# EAGLE board PCB-Neopixel Developer (EAGLE 9.5.2)
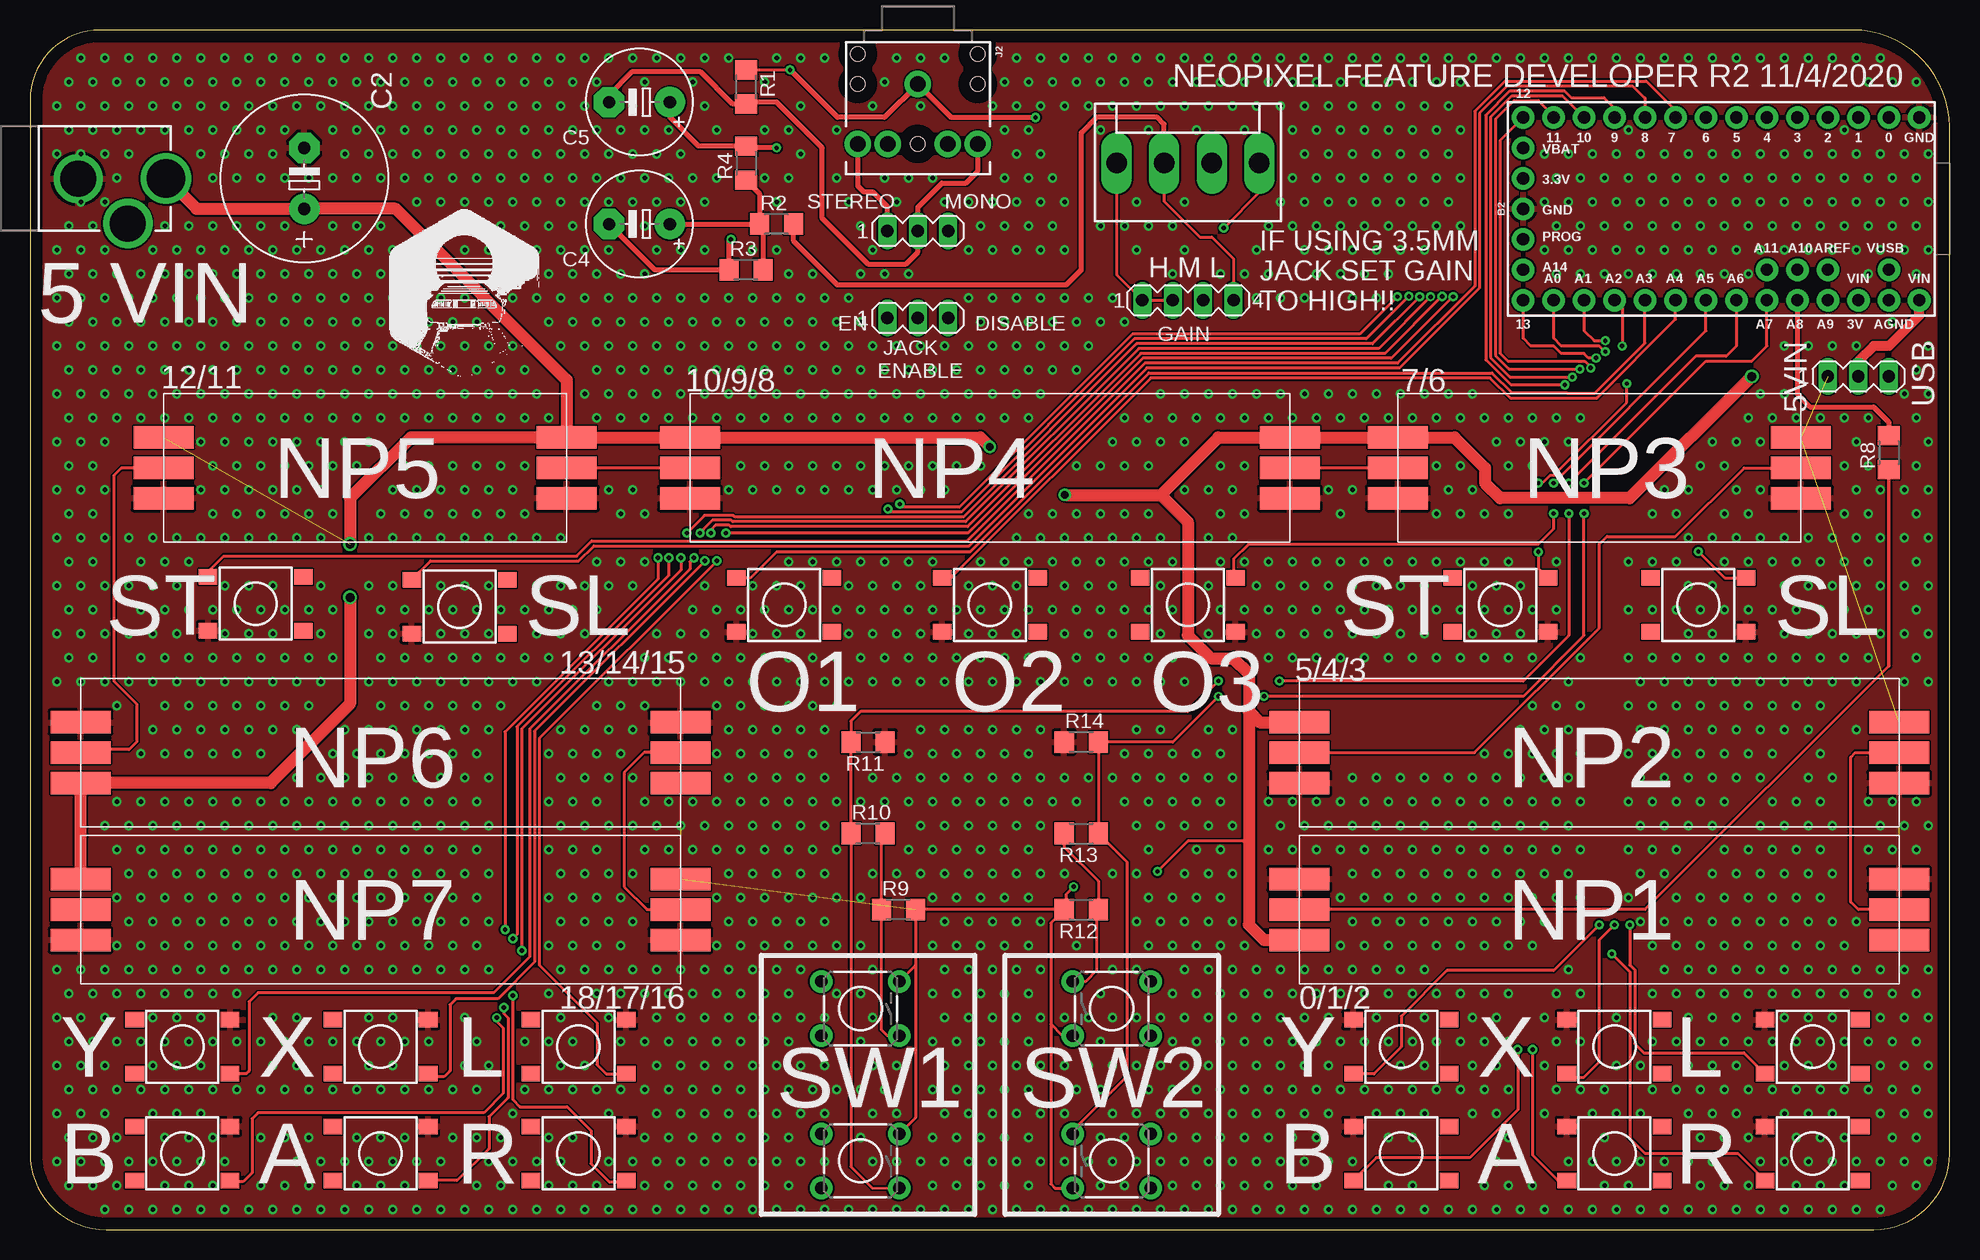
[diagram p1: board, top side]
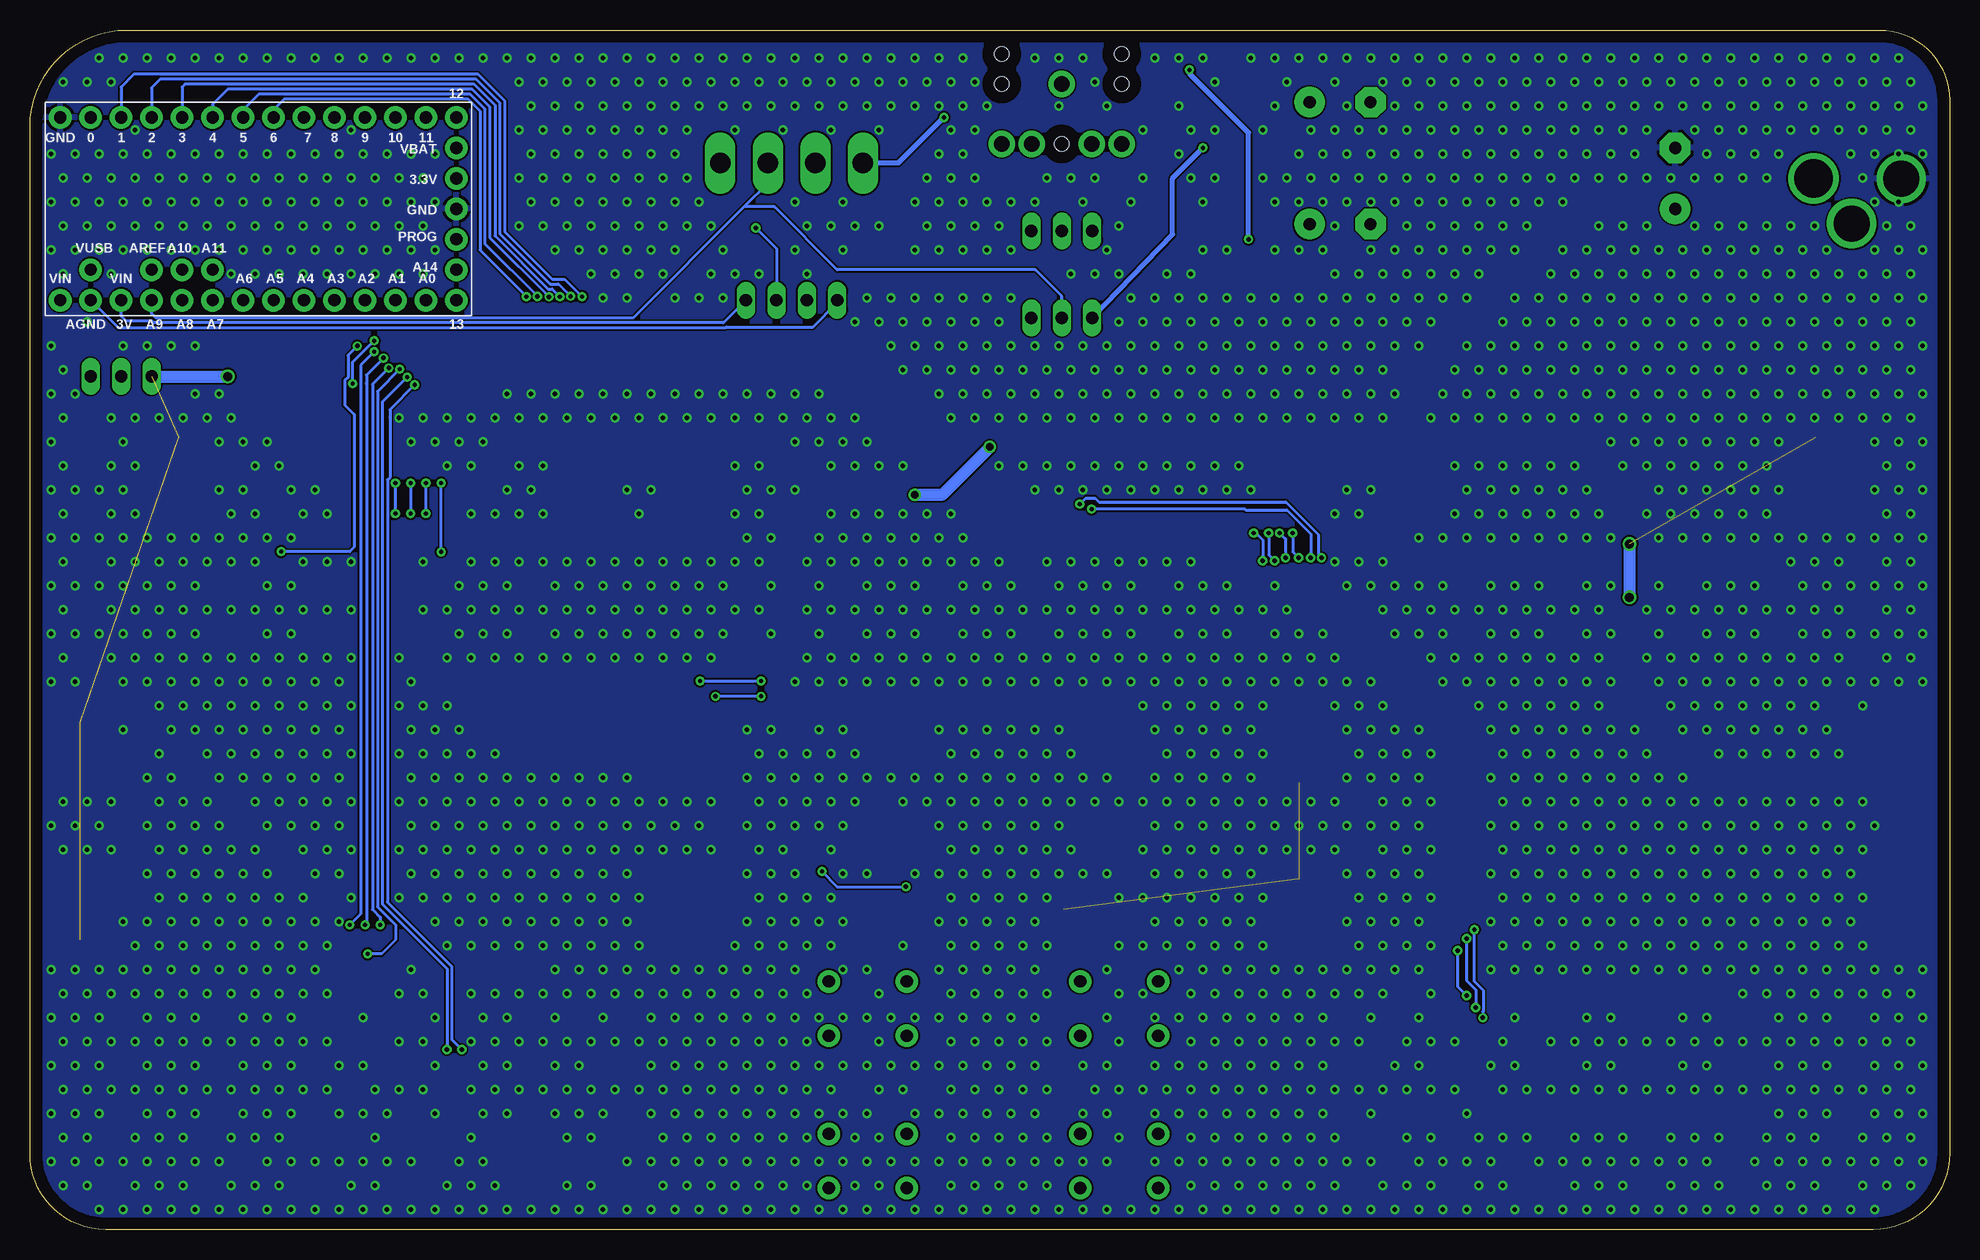
[diagram p2: board, bottom side, seen from below]

Size 160 x 100 mm. Coordinates in mm from the lower left corner, seen from the top.
Outline: 151.93,100 5.85,100 arc90 0,94.15 0,6.35 arc90 6.35,0 153.69,0 arc90 160,6.31 160,91.93 arc90 151.93,100
Copper layers (1*16): Top 0.035mm / dielectric 1.5mm / Bottom 0.035mm
Design rules "default": minimum track width 6mil, minimum drill 0.35mm, track to track 6mil, track to pad 6mil, pad to pad 6mil, via to via 6mil, smd to smd 6mil, copper to edge 40mil, drill to drill 6mil, minimum pad ring 10mil, minimum via ring 8mil, stop-mask expansion 4mil, vias tented up to drill 0.5mm, thermal gap 10mil

## Footprints (pad centres in the part's own frame; a part is rotated, then mirrored left to right if it is on the bottom)
TEENSY-3.1 = drill 1.016 pad 1.88: 0 7.62,-13.97; 1 7.62,-11.43; 2 7.62,-8.89; 3 7.62,-6.35; 3.3V 2.54,16.51; 3V -7.62,-11.43; 4 7.62,-3.81; 5 7.62,-1.27; 6 7.62,1.27; 7 7.62,3.81; 8 7.62,6.35; 9 7.62,8.89; 10 7.62,11.43; 11 7.62,13.97; 12 7.62,16.51; 13 -7.62,16.51; 14 -7.62,13.97; 15 -7.62,11.43; 16 -7.62,8.89; 17 -7.62,6.35; 18 -7.62,3.81; 19 -7.62,1.27; 20 -7.62,-1.27; 21 -7.62,-3.81; 22 -7.62,-6.35; 23 -7.62,-8.89; A10 -5.08,-6.35; A11 -5.08,-3.81; A14/DAC -5.08,16.51; AGND -7.62,-13.97; AREF -5.08,-8.89; GND 0,16.51; GND1 7.62,-16.51; PROG -2.54,16.51; VBAT 5.08,16.51; VIN -7.62,-16.51; VUSB -5.08,-13.97
E5-13 = drill 1.016 pad 2.54: + -2.54,0 | drill 1.016 pad 2.54 octagon: - 2.54,0
E5-8,5 = drill 1.016 pad 2.54: + -2.54,0 | drill 1.016 pad 2.54 octagon: - 2.54,0
MA04-1 = drill 1.016 long: 1 -3.81,0; 2 -1.27,0; 3 1.27,0; 4 3.81,0
POWER_JACK_PTH_LOCK = drill 2.997 pad 4.115: GND 0.025,6.557; GNDBREAK 3.762,10.7 | drill 3.2 pad 4.115: PWR 0,13.878
AUDIO-JACK = drill 1.3 pad 2.184: RING 5,5; RSH 5,2.5; SLEEVE 0,0; TIP 5,-5; TSH 5,-2.5 | hole 1.2: 0,5; -2.5,5; -2.5,-5; 0,-5; 5,0
KK-156-4 = drill 1.7 pad 2.184 long: 1 -5.94,0; 2 -1.98,0; 3 1.98,0; 4 5.94,0
R1206 = smd 1.6 x 1.803: 1 -1.422,0; 2 1.422,0
TACTILE_SWITCH_SMD_6.2MM_TALL = smd 1.55 x 1.3: A1 -3.975,-2.25; A2 3.975,-2.25; B1 -3.975,2.25; B2 3.975,2.25
TACTILE_SWITCH_PTH_6.0MM = drill 1.016 pad 1.88: 1 -3.251,2.261; 2 3.251,2.261; 3 -3.251,-2.261; 4 3.251,-2.261
MA03-1 = drill 1.016 long: 1 -2.54,0; 2 0,0; 3 2.54,0
NP-2 = smd 5 x 1.85: DIN 16.8,0; DOUT -16.8,0; GND -16.8,-2.54; GND1 16.8,-2.54; VIN -16.8,2.54; VOUT 16.8,2.54
NP-3 = smd 5 x 1.85: DIN 25,0; DOUT -25,0; GND -25,-2.54; GND1 25,-2.54; VIN -25,2.54; VOUT 25,2.54

## Placement (x,y rotation side)
B2  TEENSY-3.2  [TEENSY-3.1]  140.97,85.09 90 top
C2  4700uf  [E5-13]  22.86,87.63 90 top
C4  10UF  [E5-8,5]  50.8,83.82 180 top
C5  10UF  [E5-8,5]  50.8,93.98 180 top
GAIN  [MA04-1]  96.52,77.47 0 top
J1  POWER_JACKPTH_LOCK  [POWER_JACK_PTH_LOCK]  -2.54,87.63 270 top
J2  AUDIO_JACK_3.5MM_PTH  [AUDIO-JACK]  74,95.5 270 top
MICROPHONE  [KK-156-4]  96.52,88.9 0 top
R1  47K  [R1206]  59.69,95.25 270 top
R2  10K  [R1206]  62.23,83.82 0 top
R3  2.2K  [R1206]  59.69,80.01 0 top
R4  47K  [R1206]  59.69,88.9 90 top
R8  470 Ohm  [R1206]  154.94,64.77 90 top
R9  1K  [R1206]  72.39,26.67 0 top
R10  1K  [R1206]  69.85,33.02 0 top
R11  10K  [R1206]  69.85,40.64 180 top
R12  1K  [R1206]  87.63,26.67 180 top
R13  1K  [R1206]  87.63,33.02 180 top
R14  10K  [R1206]  87.63,40.64 0 top
S1  MOMENTARY-SWITCH-SPST-SMD-6.2MM-TALL  [TACTILE_SWITCH_SMD_6.2MM_TALL]  12.7,6.35 0 top
S2  MOMENTARY-SWITCH-SPST-SMD-6.2MM-TALL  [TACTILE_SWITCH_SMD_6.2MM_TALL]  29.21,6.35 0 top
S3  MOMENTARY-SWITCH-SPST-SMD-6.2MM-TALL  [TACTILE_SWITCH_SMD_6.2MM_TALL]  45.72,6.35 0 top
S4  MOMENTARY-SWITCH-SPST-SMD-6.2MM-TALL  [TACTILE_SWITCH_SMD_6.2MM_TALL]  12.7,15.24 0 top
S5  MOMENTARY-SWITCH-SPST-SMD-6.2MM-TALL  [TACTILE_SWITCH_SMD_6.2MM_TALL]  29.21,15.24 0 top
S6  MOMENTARY-SWITCH-SPST-SMD-6.2MM-TALL  [TACTILE_SWITCH_SMD_6.2MM_TALL]  45.72,15.24 0 top
S7  MOMENTARY-SWITCH-SPST-SMD-6.2MM-TALL  [TACTILE_SWITCH_SMD_6.2MM_TALL]  18.82,52.18 180 top
S8  MOMENTARY-SWITCH-SPST-SMD-6.2MM-TALL  [TACTILE_SWITCH_SMD_6.2MM_TALL]  35.8,51.93 180 top
S9  MOMENTARY-SWITCH-SPST-SMD-6.2MM-TALL  [TACTILE_SWITCH_SMD_6.2MM_TALL]  62.87,52.07 180 top
S10  MOMENTARY-SWITCH-SPST-SMD-6.2MM-TALL  [TACTILE_SWITCH_SMD_6.2MM_TALL]  80.01,52.07 180 top
S11  MOMENTARY-SWITCH-SPST-SMD-6.2MM-TALL  [TACTILE_SWITCH_SMD_6.2MM_TALL]  114.3,6.35 180 top
S12  MOMENTARY-SWITCH-SPST-SMD-6.2MM-TALL  [TACTILE_SWITCH_SMD_6.2MM_TALL]  132.08,6.35 180 top
S13  MOMENTARY-SWITCH-SPST-SMD-6.2MM-TALL  [TACTILE_SWITCH_SMD_6.2MM_TALL]  148.59,6.35 180 top
S14  MOMENTARY-SWITCH-SPST-SMD-6.2MM-TALL  [TACTILE_SWITCH_SMD_6.2MM_TALL]  114.3,15.24 180 top
S15  MOMENTARY-SWITCH-SPST-SMD-6.2MM-TALL  [TACTILE_SWITCH_SMD_6.2MM_TALL]  132.08,15.24 180 top
S16  MOMENTARY-SWITCH-SPST-SMD-6.2MM-TALL  [TACTILE_SWITCH_SMD_6.2MM_TALL]  148.59,15.24 180 top
S17  MOMENTARY-SWITCH-SPST-SMD-6.2MM-TALL  [TACTILE_SWITCH_SMD_6.2MM_TALL]  122.56,52.07 0 top
S18  MOMENTARY-SWITCH-SPST-SMD-6.2MM-TALL  [TACTILE_SWITCH_SMD_6.2MM_TALL]  139.06,52.07 0 top
S19  MOMENTARY-SWITCH-SPST-SMD-6.2MM-TALL  [TACTILE_SWITCH_SMD_6.2MM_TALL]  96.52,52.07 0 top
S20  MOMENTARY-SWITCH-SPST-PTH-6.0MM  [TACTILE_SWITCH_PTH_6.0MM]  69.22,18.41 180 top
S21  MOMENTARY-SWITCH-SPST-PTH-6.0MM  [TACTILE_SWITCH_PTH_6.0MM]  69.22,5.71 180 top
S22  MOMENTARY-SWITCH-SPST-PTH-6.0MM  [TACTILE_SWITCH_PTH_6.0MM]  90.17,18.41 0 top
S23  MOMENTARY-SWITCH-SPST-PTH-6.0MM  [TACTILE_SWITCH_PTH_6.0MM]  90.17,5.71 0 top
ST/MN  [MA03-1]  74,83.25 0 top
SV2  [MA03-1]  74,76 0 top
SV3  [MA03-1]  152.4,71.12 0 top
U$2  NP-2  [NP-2]  130.81,63.5 0 top
U$7  NP-2  [NP-2]  27.94,63.5 0 top
U$8  NP-3  [NP-3]  29.21,39.75 180 top
U$10  NP-3  [NP-3]  29.21,26.67 0 top
U$11  NP-3  [NP-3]  80.01,63.5 0 top
U$12  NP-3  [NP-3]  130.81,26.67 180 top
U$13  NP-3  [NP-3]  130.81,39.75 0 top

## Tracks (layer width: path | path; a pad name or v marks a point on that pad's centre or on a via)
3VIN
  Top 0.254: MICROPHONE.2 94.54,85.71 97.5,82.75 98.5,82.75 100.33,80.92 GAIN.4
  Top 0.406: MICROPHONE.2 94.54,92.15 93.98,92.71 88.9,92.71 87.63,91.44 87.63,80.01 86.36,78.74 67.31,78.74 63.65,82.4 R2.2
  Bottom 0.254: GAIN.4 102.21,75.59 149.67,75.59 149.82,75.75 152,75.75 152.4,76.15 B2.3V
5VIN  (via drill 0.35, 0.6, 0.75)  (6 unrouted)
  Top 0.254: 101.6,32.38 96.52,32.38 v93.98,29.84 | v87,28.57 86.36,27.94 86.36,26.82 R12.2 | R12.2 R9.2 73.81,22.02 | 73.81,22.02 S20.3 | 73.81,22.02 73.81,9.32 S21.3 | R12.2 85.09,25.55 85.09,17.14 | 85.09,17.14 85.09,3.81 85.45,3.45 S23.3 | S22.3 86.08,16.15 85.09,17.14
  Top 1.016: J1.PWR 13.88,85.09 C2.+ 30.48,85.09 44.74,70.83 U$7.VOUT | U$7.VOUT U$11.VIN 79.21,66.04 v80,65.25 | v86.25,61.25 94.27,61.25 | 94.27,61.25 99.06,66.04 U$11.VOUT U$2.VIN 118.75,66.04 121.28,63.5 121.28,62.23 122.56,60.96 133.35,60.96 v143.51,71.12 | 94.27,61.25 96.52,59 96.52,49.53 98.42,47.62 100.33,47.62 101.6,46.35 101.6,43.18 | U$13.VIN 102.49,42.29 101.6,43.18 | 101.6,43.18 101.6,32.38 101.6,25.4 102.87,24.13 U$12.VOUT | U$7.VOUT 31.75,66.04 26.67,60.96 v26.67,57.15 | v26.67,52.7 26.67,43.81 20.07,37.21 U$8.VOUT U$10.VIN
  Bottom 0.254: v93.98,29.84 92.71,28.57 v87,28.57
  Bottom 1.016: v80,65.25 84,61.25 v86.25,61.25 | SV3.1 v143.51,71.12 | v26.67,57.15 v26.67,52.7
AGND  (via drill 0.35)
  Top 0.254: MICROPHONE.1 90.58,79.6 GAIN.1 GAIN.2 | R1.1 v63.35,96.67
  Top 0.406: C4.- 52.07,80.01 R3.1 58.27,82.4 v58.42,82.55 | v63.35,96.67 67.31,92.71 71.21,92.71 J2.SLEEVE 76.79,92.71 v83.82,92.71
  Bottom 0.254: B2.AGND 152.66,75.19 102.04,75.19 101.97,75.25 94.75,75.25 92.71,77.29 GAIN.1
  Bottom 0.406: v83.82,92.71 87.63,88.9 MICROPHONE.1 | v58.42,82.55 58.42,91.44 63.35,96.37 v63.35,96.67
D1
  Top 0.254: U$12.DIN 134.62,26.67 154.94,46.99
  Top 0.305: R8.1 154.94,46.99
D2
  Top 0.254: U$12.DOUT 152.4,26.67 151.76,27.3 151.76,39.37 152.15,39.75 U$13.DIN
D3
  Top 0.254: U$13.DOUT 120.4,39.75 130.81,50.16 130.81,57.15 131.44,57.78 137.16,57.78 142.88,63.5 U$2.DIN
D4
  Top 0.254: U$2.DOUT U$11.DIN
D5
  Top 0.254: U$11.DOUT U$7.DIN
D6
  Top 0.254: U$8.DIN 4.46,40.01 8.26,40.01 8.89,40.64 8.89,43.81 6.99,45.72 6.99,62.87 7.62,63.5 U$7.DOUT
D7
  Top 0.254: U$8.DOUT 51.18,39.75 49.53,38.1 49.53,28.57 51.44,26.67 U$10.DIN
GAIN  (via drill 0.35)
  Top 0.254: MICROPHONE.4 102.46,86.46 v99.5,83.5
  Bottom 0.254: GAIN.3 97.75,77.51 97.75,81.75 v99.5,83.5
GND  (via drill 0.35)
  other vias: 2.25,5.67 2.25,9.67 2.25,13.67 2.25,17.67 2.25,21.67 2.25,45.67 2.25,49.67 2.25,53.67 2.25,57.67 2.25,61.67 2.25,65.67 2.25,69.67 2.25,73.67 2.25,77.67 2.25,81.67 2.25,89.67 2.25,93.67 3.25,3.67 4.25,5.67 3.25,7.67 4.25,9.67 3.25,11.67 4.25,13.67 3.25,15.67 4.25,17.67 3.25,19.67 4.25,21.67 4.25,45.67 3.25,47.67 4.25,49.67 3.25,51.67 4.25,53.67 3.25,55.67 4.25,57.67 3.25,59.67 4.25,61.67 3.25,63.67 4.25,65.67 3.25,67.67 4.25,69.67 3.25,71.67 4.25,73.67 3.25,75.67 4.25,77.67 3.25,79.67 4.25,81.67 3.25,83.67 4.25,85.67 4.25,89.67 3.25,91.67 4.25,93.67 3.25,95.67 4.25,97.67 6.25,1.67 5.25,3.67 6.25,5.67 5.25,7.67 6.25,9.67 5.25,11.67 6.25,13.67 5.25,15.67 6.25,17.67 5.25,19.67 6.25,21.67 6.25,33.67 6.25,45.67 5.25,47.67 6.25,49.67 5.25,51.67 6.25,53.67 5.25,55.67 6.25,57.67 5.25,59.67 6.25,61.67 5.25,63.67 6.25,65.67 5.25,67.67 6.25,69.67 5.25,71.67 6.25,73.67 5.25,75.67 6.25,77.67 5.25,79.67 6.25,81.67 5.25,83.67 6.25,85.67 6.25,89.67 5.25,91.67 6.25,93.67 5.25,95.67 6.25,97.67 8.25,1.67 7.25,3.67 8.25,5.67 7.25,7.67 7.25,11.67 7.25,15.67 7.25,19.67 8.25,21.67 7.25,23.67 8.25,25.67 7.25,27.67 8.25,29.67 7.25,31.67 8.25,33.67 7.25,35.67 7.25,43.67 8.25,45.67 8.25,49.67 8.25,53.67 8.25,57.67 7.25,67.67 8.25,69.67 7.25,71.67 8.25,73.67 7.25,75.67 8.25,77.67 7.25,79.67 7.25,87.67 8.25,89.67 7.25,91.67 8.25,93.67 7.25,95.67 8.25,97.67 10.25,1.67 10.25,5.67 10.25,9.67 9.25,11.67 10.25,13.67 9.25,15.67 10.25,17.67 9.25,19.67 10.25,21.67 9.25,23.67 10.25,25.67 9.25,27.67 10.25,29.67 9.25,31.67 10.25,33.67 9.25,35.67 9.25,39.67 10.25,41.67 10.25,45.67 9.25,47.67 10.25,49.67 9.25,51.67 10.25,53.67 9.25,55.67 10.25,57.67 9.25,67.67 10.25,69.67 9.25,71.67 10.25,73.67 9.25,75.67 10.25,77.67 9.25,79.67 10.25,81.67 9.25,91.67 10.25,93.67 9.25,95.67 10.25,97.67 12.25,1.67 11.25,3.67 12.25,5.67 11.25,7.67 12.25,9.67 11.25,11.67 12.25,13.67 11.25,15.67 12.25,17.67 11.25,19.67 12.25,21.67 11.25,23.67 12.25,25.67 11.25,27.67 12.25,29.67 11.25,31.67 12.25,33.67 11.25,35.67 11.25,39.67 12.25,41.67 11.25,43.67 12.25,45.67 11.25,47.67 12.25,49.67 11.25,51.67 12.25,53.67 11.25,55.67 12.25,57.67 11.25,67.67 12.25,69.67 11.25,71.67 12.25,73.67 11.25,75.67 12.25,77.67 11.25,79.67 12.25,81.67 11.25,83.67 11.25,91.67 12.25,93.67 11.25,95.67 12.25,97.67 14.25,1.67 13.25,3.67 14.25,5.67 13.25,7.67 14.25,9.67 13.25,11.67 14.25,13.67 13.25,15.67 14.25,17.67 13.25,19.67 14.25,21.67 13.25,23.67 14.25,25.67 13.25,27.67 14.25,29.67 13.25,31.67 14.25,33.67 13.25,35.67 13.25,39.67 14.25,41.67 13.25,43.67 14.25,45.67 13.25,47.67 13.25,51.67 13.25,55.67 14.25,57.67 14.25,61.67 14.25,65.67 13.25,67.67 14.25,69.67 13.25,71.67 14.25,73.67 13.25,75.67 14.25,77.67 13.25,79.67 14.25,81.67 13.25,83.67 14.25,89.67 13.25,91.67 14.25,93.67 13.25,95.67 14.25,97.67 16.25,1.67 15.25,3.67 16.25,5.67 15.25,7.67 15.25,11.67 15.25,15.67 15.25,19.67 16.25,21.67 15.25,23.67 16.25,25.67 15.25,27.67 16.25,29.67 15.25,31.67 16.25,33.67 15.25,35.67 15.25,39.67 16.25,41.67 15.25,43.67 16.25,45.67 15.25,47.67 16.25,49.67 15.25,51.67 16.25,53.67 16.25,57.67 15.25,59.67 16.25,61.67 15.25,63.67 16.25,65.67 15.25,67.67 16.25,69.67 15.25,71.67 16.25,73.67 15.25,75.67 16.25,77.67 15.25,79.67 16.25,81.67 15.25,83.67 15.25,87.67 16.25,89.67 15.25,91.67 16.25,93.67 15.25,95.67 16.25,97.67 18.25,1.67 17.25,11.67 17.25,15.67 17.25,19.67 18.25,21.67 17.25,23.67 18.25,25.67 17.25,27.67 18.25,29.67 17.25,31.67 18.25,33.67 17.25,35.67 17.25,39.67 18.25,41.67 17.25,43.67 18.25,45.67 17.25,47.67 18.25,49.67 17.25,51.67 18.25,53.67 18.25,57.67 17.25,59.67 18.25,61.67 17.25,63.67 18.25,65.67 17.25,67.67 18.25,69.67 17.25,71.67 18.25,73.67 17.25,75.67 18.25,77.67 17.25,79.67 18.25,81.67 17.25,83.67 17.25,87.67 18.25,89.67 17.25,91.67 18.25,93.67 17.25,95.67 18.25,97.67 20.25,1.67 19.25,3.67 20.25,5.67 19.25,7.67 19.25,11.67 20.25,13.67 19.25,15.67 20.25,17.67 20.25,21.67 19.25,23.67 20.25,25.67 19.25,27.67 20.25,29.67 19.25,31.67 20.25,33.67 19.25,35.67 19.25,39.67 20.25,41.67 19.25,43.67 20.25,45.67 19.25,47.67 20.25,49.67 19.25,51.67 20.25,53.67 20.25,57.67 19.25,59.67 20.25,61.67 19.25,63.67 20.25,65.67 19.25,67.67 20.25,69.67 19.25,71.67 20.25,73.67 19.25,75.67 20.25,77.67 19.25,79.67 20.25,81.67 19.25,83.67 19.25,87.67 20.25,89.67 19.25,91.67 20.25,93.67 19.25,95.67 20.25,97.67 22.25,1.67 21.25,3.67 22.25,5.67 21.25,7.67 21.25,11.67 22.25,13.67 21.25,15.67 22.25,17.67 22.25,21.67 21.25,23.67 22.25,25.67 21.25,27.67 22.25,29.67 21.25,31.67 22.25,33.67 21.25,35.67 22.25,37.67 22.25,41.67 21.25,43.67 22.25,45.67 21.25,47.67 21.25,51.67 22.25,57.67 21.25,59.67 22.25,61.67 21.25,63.67 22.25,65.67 21.25,67.67 22.25,69.67 21.25,71.67 22.25,73.67 21.25,75.67 22.25,77.67 21.25,79.67 22.25,81.67 21.25,83.67 21.25,87.67 21.25,91.67 22.25,93.67 21.25,95.67 22.25,97.67 24.25,1.67 23.25,3.67 24.25,5.67 23.25,7.67 23.25,11.67 23.25,15.67 24.25,21.67 23.25,23.67 24.25,25.67 23.25,27.67 24.25,29.67 23.25,31.67 24.25,33.67 23.25,35.67 24.25,37.67 23.25,43.67 24.25,45.67 23.25,47.67 24.25,49.67 23.25,51.67 24.25,53.67 24.25,57.67 23.25,59.67 24.25,61.67 23.25,63.67 24.25,65.67 23.25,67.67 24.25,69.67 23.25,71.67 24.25,73.67 23.25,75.67 24.25,77.67 23.25,79.67 24.25,81.67 23.25,87.67 24.25,93.67 23.25,95.67 24.25,97.67 26.25,1.67 26.25,5.67 25.25,11.67 25.25,15.67 26.25,21.67 25.25,23.67 26.25,25.67 25.25,27.67 26.25,29.67 25.25,31.67 26.25,33.67 25.25,35.67 26.25,37.67 25.25,39.67 26.25,41.67 25.25,47.67 25.25,51.67 25.25,59.67 25.25,63.67 26.25,65.67 25.25,67.67 26.25,69.67 25.25,71.67 26.25,73.67 25.25,75.67 26.25,77.67 25.25,79.67 26.25,81.67 25.25,83.67 25.25,87.67 26.25,89.67 25.25,91.67 26.25,93.67 25.25,95.67 26.25,97.67 28.25,1.67 27.25,3.67 28.25,5.67 27.25,7.67 27.25,11.67 28.25,13.67 27.25,15.67 28.25,17.67 28.25,21.67 27.25,23.67 28.25,25.67 27.25,27.67 28.25,29.67 27.25,31.67 28.25,33.67 27.25,35.67 28.25,37.67 27.25,39.67 28.25,41.67 28.25,45.67 28.25,49.67 28.25,53.67 28.25,57.67 27.25,63.67 28.25,65.67 27.25,67.67 28.25,69.67 27.25,71.67 28.25,73.67 27.25,75.67 28.25,77.67 27.25,79.67 28.25,81.67 27.25,83.67 27.25,87.67 28.25,89.67 27.25,91.67 28.25,93.67 27.25,95.67 28.25,97.67 30.25,1.67 29.25,3.67 30.25,5.67 29.25,7.67 29.25,11.67 30.25,13.67 29.25,15.67 30.25,17.67 30.25,21.67 29.25,23.67 30.25,25.67 29.25,27.67 30.25,29.67 29.25,31.67 30.25,33.67 29.25,35.67 30.25,37.67 29.25,39.67 30.25,41.67 29.25,43.67 30.25,45.67 29.25,47.67 30.25,49.67 29.25,51.67 30.25,53.67 30.25,57.67 29.25,59.67 30.25,61.67 29.25,67.67 30.25,69.67 29.25,71.67 30.25,73.67 29.25,75.67 30.25,77.67 29.25,79.67 30.25,81.67 29.25,83.67 29.25,87.67 30.25,89.67 29.25,91.67 30.25,93.67 29.25,95.67 30.25,97.67 32.25,1.67 31.25,3.67 32.25,5.67 31.25,7.67 31.25,11.67 31.25,15.67 32.25,21.67 31.25,23.67 32.25,25.67 31.25,27.67 32.25,29.67 31.25,31.67 32.25,33.67 31.25,35.67 32.25,37.67 31.25,39.67 32.25,41.67 31.25,43.67 32.25,45.67 31.25,47.67 31.25,51.67 32.25,57.67 31.25,59.67 32.25,61.67 31.25,63.67 31.25,67.67 32.25,69.67 31.25,71.67 32.25,73.67 31.25,75.67 32.25,77.67 31.25,79.67 32.25,81.67 32.25,85.67 31.25,87.67 32.25,89.67 31.25,91.67 32.25,93.67 31.25,95.67 32.25,97.67 34.25,1.67 34.25,5.67 33.25,11.67 33.25,15.67 34.25,21.67 33.25,23.67 34.25,25.67 33.25,27.67 34.25,29.67 33.25,31.67 34.25,33.67 33.25,35.67 34.25,37.67 33.25,39.67 34.25,41.67 33.25,43.67 34.25,45.67 33.25,47.67 34.25,49.67 33.25,51.67 34.25,53.67 34.25,57.67 33.25,59.67 34.25,61.67 33.25,63.67 33.25,67.67 34.25,69.67 33.25,71.67 34.25,73.67 33.25,75.67 34.25,77.67 33.25,79.67 34.25,85.67 33.25,87.67 34.25,89.67 33.25,91.67 34.25,93.67 33.25,95.67 34.25,97.67 36.25,1.67 35.25,7.67 35.25,11.67 36.25,13.67 36.25,17.67 36.25,21.67 35.25,23.67 36.25,25.67 35.25,27.67 36.25,29.67 35.25,31.67 36.25,33.67 35.25,35.67 36.25,37.67 35.25,39.67 36.25,41.67 35.25,43.67 36.25,45.67 35.25,47.67 36.25,49.67 35.25,51.67 36.25,53.67 36.25,57.67 35.25,59.67 36.25,61.67 35.25,63.67 35.25,67.67 36.25,69.67 35.25,71.67 36.25,73.67 35.25,75.67 36.25,77.67 36.25,81.67 35.25,83.67 36.25,85.67 35.25,87.67 36.25,89.67 35.25,91.67 36.25,93.67 35.25,95.67 36.25,97.67 38.25,1.67 37.25,3.67 38.25,5.67 37.25,7.67 37.25,11.67 38.25,13.67 37.25,15.67 38.25,21.67 37.25,23.67 38.25,25.67 37.25,27.67 38.25,29.67 37.25,31.67 38.25,33.67 37.25,35.67 38.25,37.67 37.25,39.67 38.25,41.67 37.25,43.67 38.25,45.67 37.25,47.67 38.25,49.67 37.25,51.67 38.25,53.67 38.25,57.67 37.25,59.67 38.25,61.67 37.25,63.67 37.25,67.67 38.25,69.67 37.25,71.67 38.25,73.67 37.25,75.67 38.25,81.67 37.25,83.67 38.25,85.67 37.25,87.67 38.25,89.67 37.25,91.67 38.25,93.67 37.25,95.67 38.25,97.67 40.25,1.67 39.25,3.67 40.25,5.67 39.25,7.67 40.25,9.67 39.25,43.67 40.25,45.67 39.25,47.67 39.25,51.67 40.25,57.67 39.25,59.67 40.25,61.67 39.25,63.67 39.25,67.67 40.25,69.67 39.25,71.67 40.25,73.67 40.25,77.67 39.25,79.67 40.25,81.67 39.25,83.67 40.25,85.67 39.25,87.67 40.25,89.67 39.25,91.67 40.25,93.67 39.25,95.67 40.25,97.67 42.25,1.67 42.25,5.67 41.25,11.67 41.25,15.67 42.25,45.67 41.25,47.67 42.25,49.67 41.25,51.67 42.25,53.67 42.25,57.67 41.25,59.67 41.25,63.67 41.25,67.67 42.25,69.67 41.25,71.67 42.25,77.67 41.25,79.67 42.25,81.67 41.25,83.67 42.25,85.67 41.25,87.67 42.25,89.67 41.25,91.67 42.25,93.67 41.25,95.67 42.25,97.67 44.25,1.67 43.25,3.67 44.25,5.67 43.25,7.67 43.25,11.67 44.25,13.67 43.25,15.67 44.25,17.67 43.25,19.67 44.25,21.67 43.25,23.67 44.25,25.67 43.25,27.67 44.25,29.67 43.25,31.67 44.25,33.67 43.25,35.67 44.25,37.67 43.25,39.67 44.25,41.67 43.25,47.67 44.25,49.67 43.25,51.67 44.25,53.67 44.25,57.67 43.25,67.67 44.25,73.67 43.25,75.67 44.25,77.67 43.25,79.67 44.25,81.67 43.25,83.67 44.25,85.67 43.25,87.67 44.25,89.67 43.25,91.67 44.25,93.67 43.25,95.67 44.25,97.67 46.25,1.67 45.25,3.67 45.25,7.67 45.25,11.67 46.25,13.67 45.25,15.67 46.25,21.67 45.25,23.67 46.25,25.67 45.25,27.67 46.25,29.67 45.25,31.67 46.25,33.67 45.25,35.67 46.25,37.67 45.25,39.67 46.25,41.67 46.25,49.67 45.25,51.67 46.25,53.67 46.25,69.67 46.25,73.67 45.25,75.67 46.25,77.67 45.25,79.67 46.25,81.67 45.25,83.67 46.25,85.67 45.25,87.67 46.25,89.67 45.25,91.67 46.25,93.67 45.25,95.67 46.25,97.67 48.25,1.67 47.25,3.67 48.25,5.67 48.25,9.67 47.25,11.67 48.25,17.67 47.25,19.67 48.25,21.67 47.25,23.67 48.25,25.67 47.25,27.67 48.25,29.67 47.25,31.67 48.25,33.67 47.25,35.67 48.25,37.67 47.25,39.67 48.25,41.67 47.25,43.67 48.25,45.67 47.25,51.67 48.25,53.67 47.25,55.67 48.25,61.67 47.25,67.67 48.25,69.67 47.25,71.67 48.25,73.67 47.25,75.67 48.25,77.67 47.25,79.67 48.25,81.67 48.25,85.67 47.25,87.67 48.25,89.67 47.25,91.67 47.25,95.67 48.25,97.67 50.25,1.67 50.25,5.67 49.25,11.67 49.25,15.67 49.25,19.67 50.25,21.67 49.25,23.67 50.25,25.67 49.25,27.67 50.25,29.67 50.25,33.67 50.25,37.67 49.25,39.67 50.25,41.67 49.25,43.67 50.25,45.67 50.25,53.67 49.25,55.67 49.25,59.67 50.25,61.67 49.25,67.67 50.25,69.67 49.25,71.67 50.25,73.67 49.25,75.67 50.25,77.67 49.25,79.67 50.25,85.67 49.25,87.67 50.25,89.67 49.25,91.67 50.25,93.67 50.25,97.67 52.25,1.67 51.25,3.67 52.25,5.67 51.25,7.67 52.25,9.67 51.25,11.67 52.25,13.67 51.25,15.67 52.25,17.67 51.25,19.67 52.25,21.67 51.25,31.67 52.25,33.67 51.25,35.67 51.25,43.67 52.25,45.67 51.25,47.67 52.25,49.67 51.25,55.67 51.25,59.67 51.25,67.67 52.25,69.67 51.25,71.67 52.25,73.67 51.25,75.67 52.25,77.67 51.25,79.67 52.25,81.67 51.25,83.67 52.25,85.67 51.25,87.67 52.25,89.67 51.25,91.67 51.25,95.67 52.25,97.67 54.25,1.67 53.25,3.67 54.25,5.67 53.25,7.67 54.25,9.67 53.25,11.67 54.25,13.67 53.25,15.67 54.25,17.67 53.25,19.67 54.25,21.67 53.25,31.67 54.25,33.67 53.25,35.67 54.25,45.67 53.25,47.67 54.25,49.67 53.25,67.67 54.25,69.67 53.25,71.67 54.25,73.67 53.25,75.67 54.25,77.67 54.25,81.67 54.25,85.67 53.25,87.67 54.25,89.67 53.25,91.67 54.25,97.67 56.25,1.67 55.25,3.67 56.25,5.67 55.25,7.67 56.25,9.67 55.25,11.67 56.25,13.67 55.25,15.67 56.25,17.67 55.25,19.67 56.25,21.67 55.25,31.67 56.25,33.67 55.25,35.67 56.25,45.67 55.25,47.67 56.25,49.67 55.25,51.67 56.25,53.67 55.25,67.67 56.25,69.67 55.25,71.67 56.25,73.67 55.25,75.67 56.25,77.67 56.25,81.67 56.25,85.67 55.25,87.67 56.25,93.67 55.25,95.67 56.25,97.67 58.25,1.67 57.25,3.67 58.25,5.67 57.25,7.67 58.25,9.67 57.25,11.67 58.25,13.67 57.25,15.67 58.25,17.67 57.25,19.67 58.25,21.67 57.25,23.67 58.25,25.67 57.25,27.67 58.25,29.67 57.25,31.67 58.25,33.67 57.25,35.67 58.25,37.67 57.25,39.67 58.25,41.67 57.25,43.67 58.25,45.67 57.25,47.67 57.25,51.67 58.25,61.67 57.25,67.67 58.25,69.67 57.25,71.67 58.25,73.67 57.25,75.67 58.25,77.67 57.25,87.67 57.25,91.67 58.25,97.67 60.25,1.67 59.25,3.67 60.25,5.67 59.25,7.67 60.25,9.67 59.25,11.67 60.25,13.67 59.25,15.67 60.25,17.67 59.25,19.67 60.25,21.67 59.25,23.67 60.25,25.67 59.25,27.67 60.25,29.67 59.25,31.67 60.25,33.67 59.25,35.67 60.25,37.67 59.25,39.67 60.25,41.67 59.25,43.67 60.25,45.67 59.25,47.67 60.25,49.67 59.25,51.67 60.25,53.67 60.25,61.67 59.25,63.67 59.25,67.67 60.25,69.67 59.25,71.67 60.25,73.67 59.25,75.67 60.25,77.67 60.25,81.67 62.25,1.67 61.25,3.67 62.25,5.67 61.25,7.67 62.25,9.67 61.25,11.67 62.25,13.67 61.25,15.67 62.25,17.67 61.25,19.67 62.25,21.67 61.25,23.67 62.25,25.67 61.25,27.67 62.25,29.67 61.25,31.67 62.25,33.67 61.25,35.67 62.25,37.67 61.25,39.67 62.25,41.67 61.25,43.67 62.25,45.67 61.25,47.67 62.25,49.67 61.25,51.67 62.25,53.67 62.25,61.67 61.25,63.67 61.25,67.67 62.25,69.67 61.25,71.67 62.25,73.67 61.25,75.67 62.25,77.67 62.25,81.67 62.25,85.67 61.25,87.67 61.25,91.67 61.25,95.67 62.25,97.67 64.25,1.67 63.25,3.67 64.25,5.67 63.25,7.67 64.25,9.67 63.25,11.67 64.25,13.67 63.25,15.67 64.25,17.67 63.25,19.67 64.25,21.67 63.25,23.67 64.25,25.67 63.25,27.67 64.25,29.67 63.25,31.67 64.25,33.67 63.25,35.67 64.25,37.67 63.25,39.67 64.25,41.67 63.25,43.67 64.25,45.67 63.25,47.67 64.25,49.67 63.25,51.67 64.25,53.67 63.25,55.67 64.25,61.67 63.25,63.67 63.25,67.67 64.25,69.67 63.25,71.67 64.25,73.67 63.25,75.67 64.25,77.67 63.25,79.67 63.25,87.67 64.25,89.67 63.25,91.67 64.25,93.67 64.25,97.67 66.25,1.67 66.25,5.67 66.25,9.67 65.25,11.67 66.25,13.67 66.25,17.67 65.25,23.67 66.25,25.67 65.25,27.67 66.25,29.67 65.25,31.67 66.25,33.67 65.25,35.67 66.25,37.67 65.25,39.67 66.25,41.67 65.25,43.67 66.25,45.67 65.25,47.67 65.25,51.67 65.25,55.67 66.25,61.67 65.25,63.67 65.25,67.67 66.25,69.67 65.25,71.67 66.25,73.67 65.25,75.67 66.25,77.67 65.25,79.67 66.25,97.67 68.25,1.67 67.25,11.67 67.25,19.67 67.25,23.67 67.25,27.67 67.25,31.67 67.25,35.67 67.25,43.67 68.25,45.67 67.25,47.67 68.25,49.67 67.25,51.67 68.25,53.67 67.25,55.67 68.25,61.67 67.25,63.67 67.25,67.67 68.25,69.67 67.25,71.67 68.25,73.67 67.25,75.67 68.25,77.67 68.25,85.67 67.25,87.67 67.25,91.67 70.25,1.67 70.25,5.67 69.25,7.67 70.25,9.67 69.25,11.67 70.25,13.67 69.25,15.67 70.25,17.67 69.25,19.67 70.25,21.67 69.25,23.67 69.25,27.67 70.25,29.67 69.25,35.67 70.25,37.67 70.25,45.67 69.25,47.67 70.25,49.67 69.25,51.67 70.25,53.67 69.25,55.67 70.25,61.67 69.25,63.67 69.25,67.67 70.25,69.67 69.25,71.67 70.25,73.67 69.25,75.67 69.25,79.67 70.25,81.67 69.25,83.67 70.25,93.67 72.25,1.67 72.25,5.67 72.25,9.67 71.25,11.67 72.25,13.67 72.25,29.67 71.25,35.67 72.25,37.67 72.25,45.67 71.25,47.67 72.25,49.67 71.25,51.67 72.25,53.67 71.25,55.67 72.25,61.67 71.25,63.67 71.25,67.67 72.25,69.67 71.25,71.67 72.25,73.67 71.25,79.67 72.25,85.67 71.25,87.67 71.25,95.67 72.25,97.67 74.25,1.67 74.25,5.67 74.25,29.67 73.25,31.67 74.25,33.67 73.25,35.67 74.25,37.67 73.25,39.67 74.25,41.67 74.25,45.67 73.25,47.67 74.25,49.67 73.25,51.67 74.25,53.67 73.25,55.67 74.25,61.67 73.25,63.67 73.25,67.67 74.25,69.67 73.25,71.67 74.25,73.67 73.25,79.67 73.25,87.67 74.25,93.67 74.25,97.67 76.25,1.67 75.25,3.67 76.25,5.67 75.25,7.67 76.25,9.67 75.25,11.67 76.25,13.67 75.25,15.67 76.25,17.67 75.25,19.67 76.25,21.67 75.25,23.67 76.25,25.67 75.25,27.67 76.25,29.67 75.25,31.67 76.25,33.67 75.25,35.67 76.25,37.67 75.25,39.67 76.25,41.67 76.25,45.67 75.25,47.67 75.25,51.67 75.25,55.67 76.25,61.67 75.25,63.67 75.25,67.67 76.25,69.67 75.25,71.67 76.25,73.67 76.25,85.67 75.25,87.67 76.25,97.67 78.25,1.67 77.25,3.67 78.25,5.67 77.25,7.67 78.25,9.67 77.25,11.67 78.25,13.67 77.25,15.67 78.25,17.67 77.25,19.67 78.25,21.67 77.25,23.67 78.25,25.67 77.25,27.67 78.25,29.67 77.25,31.67 78.25,33.67 77.25,35.67 78.25,37.67 77.25,39.67 78.25,41.67 78.25,45.67 77.25,47.67 78.25,49.67 77.25,51.67 78.25,53.67 77.25,63.67 77.25,67.67 78.25,69.67 77.25,71.67 78.25,73.67 78.25,77.67 78.25,81.67 78.25,85.67 80.25,1.67 79.25,3.67 80.25,5.67 79.25,7.67 80.25,9.67 79.25,11.67 80.25,13.67 79.25,15.67 80.25,17.67 79.25,19.67 80.25,21.67 79.25,23.67 80.25,25.67 79.25,27.67 80.25,29.67 79.25,31.67 80.25,33.67 79.25,35.67 80.25,37.67 79.25,39.67 80.25,41.67 80.25,45.67 79.25,47.67 80.25,49.67 79.25,51.67 80.25,53.67 79.25,55.67 79.25,63.67 79.25,67.67 80.25,69.67 79.25,71.67 80.25,73.67 79.25,75.67 80.25,77.67 80.25,81.67 79.25,83.67 80.25,85.67 80.25,93.67 82.25,1.67 81.25,3.67 82.25,5.67 81.25,7.67 82.25,9.67 81.25,11.67 82.25,13.67 81.25,15.67 82.25,17.67 81.25,19.67 82.25,21.67 81.25,23.67 82.25,25.67 81.25,27.67 82.25,29.67 81.25,31.67 82.25,33.67 81.25,35.67 82.25,37.67 81.25,39.67 82.25,41.67 82.25,45.67 81.25,47.67 82.25,49.67 81.25,51.67 82.25,53.67 81.25,55.67 82.25,57.67 81.25,67.67 82.25,69.67 81.25,71.67 82.25,73.67 81.25,75.67 82.25,77.67 82.25,81.67 81.25,83.67 82.25,85.67 81.25,87.67 82.25,89.67 81.25,91.67 82.25,93.67 81.25,95.67 82.25,97.67 84.25,1.67 83.25,3.67 84.25,5.67 83.25,7.67 84.25,9.67 83.25,11.67 84.25,13.67 83.25,15.67 84.25,17.67 83.25,19.67 84.25,21.67 83.25,23.67 84.25,25.67 83.25,27.67 84.25,29.67 83.25,31.67 84.25,33.67 83.25,35.67 84.25,37.67 83.25,39.67 84.25,41.67 84.25,45.67 83.25,47.67 83.25,51.67 83.25,55.67 84.25,57.67 83.25,59.67 83.25,67.67 84.25,69.67 83.25,71.67 84.25,73.67 83.25,75.67 84.25,77.67 84.25,81.67 83.25,83.67 84.25,85.67 83.25,87.67 84.25,89.67 83.25,91.67 84.25,93.67 83.25,95.67 84.25,97.67 86.25,1.67 86.25,5.67 86.25,9.67 86.25,13.67 86.25,17.67 86.25,29.67 85.25,35.67 86.25,37.67 86.25,45.67 85.25,47.67 86.25,49.67 85.25,51.67 86.25,53.67 85.25,55.67 86.25,57.67 85.25,59.67 85.25,71.67 86.25,73.67 85.25,75.67 86.25,77.67 86.25,81.67 85.25,83.67 86.25,85.67 85.25,87.67 86.25,93.67 85.25,95.67 86.25,97.67 88.25,1.67 88.25,5.67 87.25,11.67 88.25,13.67 88.25,17.67 87.25,23.67 87.25,35.67 88.25,37.67 88.25,45.67 87.25,47.67 88.25,49.67 87.25,51.67 88.25,53.67 87.25,55.67 88.25,57.67 87.25,59.67 87.25,63.67 87.25,71.67 88.25,73.67 87.25,75.67 88.25,77.67 88.25,93.67 87.25,95.67 88.25,97.67 90.25,1.67 89.25,3.67 90.25,5.67 89.25,7.67 90.25,9.67 89.25,11.67 90.25,13.67 89.25,15.67 90.25,17.67 89.25,19.67 90.25,21.67 90.25,29.67 90.25,37.67 90.25,45.67 89.25,47.67 90.25,49.67 89.25,51.67 90.25,53.67 89.25,55.67 90.25,57.67 89.25,59.67 89.25,63.67 90.25,65.67 89.25,75.67 90.25,77.67 89.25,83.67 89.25,91.67 90.25,93.67 89.25,95.67 90.25,97.67 92.25,1.67 91.25,3.67 92.25,5.67 91.25,7.67 92.25,9.67 92.25,13.67 92.25,17.67 92.25,21.67 92.25,25.67 92.25,29.67 92.25,33.67 91.25,35.67 92.25,37.67 91.25,39.67 92.25,41.67 92.25,45.67 91.25,47.67 91.25,51.67 91.25,55.67 92.25,57.67 91.25,59.67 91.25,63.67 92.25,65.67 91.25,67.67 91.25,75.67 92.25,81.67 91.25,83.67 92.25,85.67 92.25,93.67 91.25,95.67 92.25,97.67 94.25,1.67 94.25,5.67 94.25,9.67 93.25,11.67 94.25,13.67 94.25,17.67 93.25,23.67 94.25,25.67 93.25,27.67 93.25,31.67 94.25,33.67 93.25,35.67 94.25,37.67 93.25,39.67 94.25,41.67 94.25,45.67 93.25,47.67 94.25,49.67 93.25,51.67 94.25,53.67 93.25,55.67 94.25,57.67 93.25,59.67 93.25,63.67 94.25,65.67 93.25,67.67 94.25,69.67 93.25,83.67 93.25,91.67 94.25,93.67 93.25,95.67 94.25,97.67 96.25,1.67 95.25,3.67 96.25,5.67 95.25,7.67 96.25,9.67 95.25,11.67 96.25,13.67 95.25,15.67 96.25,17.67 95.25,19.67 96.25,21.67 95.25,23.67 96.25,25.67 95.25,27.67 96.25,29.67 96.25,33.67 95.25,35.67 96.25,37.67 95.25,39.67 96.25,45.67 95.25,47.67 95.25,51.67 95.25,55.67 96.25,61.67 96.25,65.67 95.25,67.67 96.25,69.67 95.25,79.67 96.25,81.67 95.25,83.67 96.25,85.67 96.25,93.67 95.25,95.67 96.25,97.67 98.25,1.67 97.25,3.67 98.25,5.67 97.25,7.67 98.25,9.67 97.25,11.67 98.25,13.67 97.25,15.67 98.25,17.67 97.25,19.67 98.25,21.67 97.25,23.67 98.25,25.67 97.25,27.67 98.25,29.67 97.25,31.67 98.25,33.67 97.25,35.67 98.25,37.67 97.25,39.67 98.25,41.67 98.25,49.67 98.25,53.67 98.25,57.67 98.25,61.67 97.25,67.67 98.25,69.67 97.25,91.67 98.25,93.67 97.25,95.67 98.25,97.67 100.25,1.67 99.25,3.67 100.25,5.67 99.25,7.67 100.25,9.67 99.25,11.67 100.25,13.67 99.25,15.67 100.25,17.67 99.25,19.67 100.25,21.67 99.25,23.67 100.25,25.67 99.25,27.67 100.25,29.67 99.25,31.67 100.25,33.67 99.25,35.67 100.25,37.67 99.25,39.67 100.25,41.67 99.25,51.67 99.25,55.67 100.25,57.67 99.25,59.67 100.25,61.67 99.25,63.67 99.25,67.67 100.25,69.67 99.25,79.67 100.25,93.67 99.25,95.67 100.25,97.67 102.25,1.67 101.25,3.67 102.25,5.67 101.25,7.67 102.25,9.67 101.25,11.67 102.25,13.67 101.25,15.67 102.25,17.67 101.25,19.67 102.25,21.67 101.25,23.67 102.25,49.67 101.25,51.67 102.25,53.67 101.25,55.67 101.25,59.67 101.25,63.67 101.25,67.67 102.25,69.67 102.25,77.67 101.25,79.67 102.25,81.67 101.25,91.67 102.25,93.67 101.25,95.67 102.25,97.67 104.25,1.67 103.25,3.67 104.25,5.67 103.25,7.67 104.25,9.67 103.25,11.67 104.25,13.67 103.25,15.67 104.25,17.67 103.25,19.67 104.25,21.67 103.25,31.67 104.25,33.67 103.25,35.67 103.25,47.67 104.25,49.67 103.25,51.67 104.25,53.67 103.25,55.67 103.25,67.67 104.25,69.67 104.25,77.67 103.25,79.67 103.25,83.67 104.25,85.67 104.25,93.67 103.25,95.67 104.25,97.67 106.25,1.67 105.25,3.67 106.25,5.67 105.25,7.67 106.25,9.67 105.25,11.67 106.25,13.67 105.25,15.67 106.25,17.67 105.25,19.67 106.25,21.67 105.25,31.67 106.25,33.67 105.25,35.67 105.25,47.67 106.25,49.67 105.25,51.67 106.25,53.67 105.25,55.67 105.25,67.67 106.25,69.67 106.25,77.67 106.25,81.67 105.25,83.67 106.25,85.67 105.25,87.67 106.25,89.67 105.25,91.67 106.25,93.67 105.25,95.67 106.25,97.67 108.25,1.67 107.25,3.67 108.25,5.67 107.25,7.67 108.25,9.67 107.25,11.67 108.25,13.67 107.25,15.67 108.25,17.67 107.25,19.67 108.25,21.67 107.25,31.67 108.25,33.67 107.25,35.67 107.25,47.67 108.25,49.67 107.25,51.67 108.25,53.67 107.25,55.67 108.25,61.67 107.25,67.67 108.25,69.67 107.25,79.67 108.25,81.67 107.25,83.67 108.25,85.67 107.25,87.67 108.25,89.67 107.25,91.67 108.25,93.67 107.25,95.67 108.25,97.67 110.25,1.67 110.25,5.67 109.25,11.67 109.25,15.67 109.25,19.67 110.25,21.67 109.25,23.67 110.25,25.67 109.25,27.67 110.25,29.67 109.25,31.67 110.25,33.67 109.25,35.67 110.25,37.67 109.25,47.67 110.25,49.67 109.25,51.67 110.25,53.67 109.25,55.67 109.25,59.67 110.25,61.67 109.25,67.67 110.25,69.67 110.25,77.67 109.25,79.67 110.25,81.67 109.25,83.67 110.25,85.67 109.25,87.67 110.25,89.67 109.25,91.67 110.25,93.67 109.25,95.67 110.25,97.67 112.25,1.67 112.25,9.67 111.25,11.67 111.25,15.67 112.25,17.67 111.25,19.67 112.25,21.67 111.25,23.67 112.25,25.67 111.25,27.67 112.25,29.67 111.25,31.67 112.25,33.67 111.25,35.67 112.25,37.67 111.25,47.67 112.25,49.67 111.25,51.67 112.25,53.67 111.25,55.67 111.25,67.67 112.25,69.67 112.25,77.67 111.25,79.67 112.25,81.67 111.25,83.67 112.25,85.67 111.25,87.67 112.25,89.67 111.25,91.67 112.25,93.67 111.25,95.67 112.25,97.67 114.25,1.67 113.25,3.67 113.25,7.67 114.25,9.67 113.25,11.67 114.25,13.67 113.25,15.67 113.25,19.67 114.25,21.67 113.25,23.67 114.25,25.67 113.25,27.67 114.25,29.67 113.25,31.67 114.25,33.67 113.25,35.67 114.25,37.67 113.25,47.67 114.25,49.67 113.25,51.67 114.25,53.67 113.25,55.67 113.25,67.67 114.25,69.67 113.25,79.67 114.25,81.67 113.25,83.67 114.25,85.67 113.25,87.67 114.25,89.67 113.25,91.67 114.25,93.67 113.25,95.67 114.25,97.67 116.25,1.67 115.25,3.67 115.25,7.67 116.25,9.67 115.25,11.67 116.25,13.67 115.25,15.67 116.25,17.67 115.25,19.67 116.25,21.67 115.25,23.67 116.25,25.67 115.25,27.67 116.25,29.67 115.25,31.67 116.25,33.67 115.25,35.67 116.25,37.67 115.25,47.67 116.25,49.67 115.25,51.67 116.25,53.67 115.25,55.67 115.25,67.67 116.25,69.67 116.25,81.67 115.25,83.67 116.25,85.67 115.25,87.67 116.25,89.67 115.25,91.67 116.25,93.67 115.25,95.67 116.25,97.67 118.25,1.67 117.25,11.67 117.25,15.67 117.25,19.67 117.25,23.67 118.25,25.67 117.25,27.67 118.25,29.67 117.25,31.67 118.25,33.67 117.25,35.67 118.25,37.67 117.25,47.67 117.25,51.67 117.25,55.67 117.25,59.67 118.25,61.67 117.25,63.67 117.25,67.67 118.25,69.67 117.25,83.67 118.25,85.67 117.25,87.67 118.25,89.67 117.25,91.67 118.25,93.67 117.25,95.67 118.25,97.67 120.25,1.67 120.25,9.67 119.25,11.67 120.25,13.67 119.25,15.67 120.25,17.67 119.25,19.67 119.25,23.67 120.25,25.67 119.25,27.67 120.25,29.67 119.25,31.67 120.25,33.67 119.25,35.67 120.25,37.67 119.25,47.67 120.25,49.67 119.25,51.67 120.25,53.67 119.25,55.67 119.25,59.67 120.25,61.67 119.25,63.67 119.25,67.67 120.25,69.67 119.25,83.67 119.25,87.67 119.25,91.67 119.25,95.67 120.25,97.67 122.25,1.67 121.25,3.67 122.25,5.67 122.25,9.67 121.25,11.67 122.25,13.67 121.25,15.67 122.25,17.67 121.25,19.67 121.25,23.67 122.25,25.67 121.25,27.67 122.25,29.67 121.25,31.67 122.25,33.67 121.25,35.67 122.25,37.67 121.25,39.67 121.25,47.67 122.25,49.67 121.25,51.67 122.25,53.67 121.25,55.67 121.25,59.67 122.25,65.67 121.25,67.67 122.25,97.67 124.25,1.67 123.25,3.67 124.25,5.67 123.25,7.67 123.25,11.67 123.25,15.67 123.25,19.67 123.25,23.67 124.25,25.67 123.25,27.67 124.25,29.67 123.25,31.67 124.25,33.67 123.25,35.67 124.25,37.67 123.25,39.67 124.25,41.67 123.25,47.67 124.25,49.67 123.25,51.67 124.25,53.67 123.25,55.67 123.25,59.67 123.25,63.67 124.25,65.67 123.25,67.67 124.25,97.67 126.25,1.67 125.25,3.67 126.25,9.67 126.25,13.67 126.25,17.67 125.25,23.67 126.25,25.67 125.25,27.67 126.25,29.67 125.25,31.67 126.25,33.67 125.25,35.67 126.25,37.67 125.25,39.67 126.25,41.67 125.25,43.67 125.25,47.67 125.25,51.67 125.25,63.67 126.25,65.67 125.25,67.67 126.25,81.67 126.25,85.67 126.25,89.67 126.25,97.67 128.25,1.67 128.25,5.67 127.25,11.67 127.25,15.67 127.25,19.67 128.25,21.67 127.25,27.67 128.25,29.67 127.25,31.67 128.25,33.67 127.25,35.67 128.25,37.67 127.25,39.67 128.25,41.67 127.25,43.67 128.25,45.67 127.25,51.67 127.25,55.67 128.25,65.67 127.25,67.67 127.25,79.67 128.25,81.67 127.25,83.67 128.25,85.67 127.25,87.67 128.25,89.67 128.25,97.67 130.25,1.67 130.25,5.67 130.25,9.67 129.25,11.67 129.25,15.67 129.25,19.67 129.25,27.67 129.25,31.67 129.25,35.67 129.25,39.67 129.25,43.67 129.25,47.67 129.25,67.67 129.25,79.67 130.25,81.67 129.25,83.67 130.25,85.67 129.25,87.67 130.25,89.67 130.25,97.67 132.25,1.67 131.25,3.67 132.25,5.67 131.25,7.67 132.25,9.67 131.25,11.67 132.25,13.67 132.25,17.67 131.25,79.67 132.25,81.67 131.25,83.67 132.25,85.67 131.25,87.67 132.25,89.67 132.25,97.67 134.25,1.67 133.25,3.67 134.25,5.67 134.25,9.67 134.25,13.67 134.25,25.67 133.25,27.67 134.25,29.67 133.25,31.67 134.25,33.67 133.25,35.67 134.25,37.67 133.25,39.67 134.25,41.67 133.25,43.67 134.25,45.67 133.25,47.67 133.25,51.67 133.25,55.67 133.25,79.67 134.25,81.67 133.25,83.67 134.25,85.67 133.25,87.67 134.25,89.67 133.25,91.67 134.25,97.67 136.25,1.67 136.25,5.67 135.25,11.67 135.25,15.67 135.25,19.67 136.25,21.67 135.25,23.67 136.25,25.67 136.25,29.67 135.25,31.67 136.25,33.67 135.25,35.67 136.25,37.67 135.25,39.67 136.25,41.67 135.25,43.67 136.25,45.67 135.25,47.67 135.25,51.67 135.25,55.67 135.25,59.67 136.25,61.67 135.25,79.67 136.25,81.67 135.25,83.67 136.25,85.67 135.25,87.67 136.25,89.67 136.25,97.67 138.25,1.67 138.25,5.67 138.25,9.67 137.25,11.67 138.25,13.67 137.25,15.67 138.25,17.67 137.25,19.67 138.25,21.67 137.25,23.67 138.25,25.67 137.25,27.67 137.25,31.67 138.25,33.67 137.25,35.67 138.25,37.67 137.25,39.67 138.25,41.67 137.25,43.67 138.25,45.67 137.25,47.67 138.25,49.67 137.25,51.67 138.25,53.67 137.25,55.67 138.25,57.67 137.25,59.67 138.25,61.67 137.25,79.67 138.25,81.67 137.25,83.67 138.25,85.67 137.25,87.67 138.25,89.67 138.25,97.67 140.25,1.67 139.25,3.67 140.25,5.67 139.25,7.67 140.25,9.67 139.25,11.67 140.25,13.67 139.25,15.67 140.25,17.67 139.25,19.67 140.25,21.67 139.25,23.67 140.25,25.67 139.25,27.67 140.25,29.67 140.25,33.67 139.25,35.67 140.25,37.67 139.25,39.67 140.25,41.67 139.25,43.67 140.25,45.67 139.25,47.67 140.25,49.67 139.25,51.67 140.25,53.67 140.25,57.67 139.25,63.67 140.25,65.67 139.25,79.67 140.25,81.67 139.25,83.67 140.25,85.67 139.25,87.67 140.25,89.67 140.25,97.67 142.25,1.67 141.25,3.67 141.25,7.67 142.25,9.67 141.25,11.67 142.25,13.67 141.25,15.67 142.25,17.67 141.25,19.67 142.25,21.67 141.25,23.67 142.25,25.67 141.25,27.67 142.25,29.67 141.25,31.67 141.25,35.67 142.25,37.67 141.25,39.67 142.25,41.67 141.25,43.67 142.25,45.67 141.25,47.67 141.25,51.67 141.25,55.67 142.25,57.67 141.25,59.67 142.25,61.67 141.25,63.67 142.25,65.67 141.25,79.67 142.25,81.67 141.25,83.67 142.25,85.67 141.25,87.67 142.25,89.67 142.25,97.67 144.25,1.67 143.25,3.67 144.25,5.67 143.25,7.67 143.25,11.67 143.25,15.67 143.25,19.67 144.25,21.67 143.25,23.67 144.25,25.67 143.25,27.67 144.25,29.67 143.25,31.67 144.25,33.67 144.25,37.67 143.25,39.67 144.25,41.67 143.25,43.67 144.25,45.67 143.25,47.67 143.25,51.67 143.25,55.67 144.25,57.67 143.25,59.67 144.25,61.67 144.25,65.67 143.25,67.67 144.25,69.67 143.25,79.67 144.25,81.67 143.25,83.67 144.25,85.67 143.25,87.67 144.25,89.67 144.25,97.67 146.25,1.67 146.25,5.67 146.25,9.67 145.25,11.67 146.25,13.67 145.25,15.67 146.25,17.67 145.25,19.67 146.25,21.67 145.25,23.67 146.25,25.67 145.25,27.67 146.25,29.67 145.25,31.67 146.25,33.67 145.25,35.67 145.25,39.67 146.25,41.67 145.25,43.67 146.25,45.67 145.25,47.67 146.25,49.67 145.25,51.67 146.25,53.67 145.25,55.67 146.25,57.67 145.25,67.67 146.25,69.67 146.25,73.67 146.25,81.67 145.25,83.67 146.25,85.67 145.25,87.67 146.25,89.67 146.25,97.67 148.25,1.67 147.25,3.67 148.25,5.67 147.25,7.67 148.25,9.67 147.25,11.67 148.25,13.67 147.25,15.67 148.25,17.67 147.25,19.67 148.25,21.67 147.25,23.67 148.25,25.67 147.25,27.67 148.25,29.67 147.25,31.67 148.25,33.67 147.25,35.67 148.25,37.67 148.25,41.67 147.25,43.67 148.25,45.67 147.25,47.67 148.25,49.67 147.25,51.67 148.25,53.67 147.25,55.67 148.25,57.67 147.25,67.67 148.25,73.67 148.25,81.67 147.25,83.67 148.25,85.67 147.25,87.67 148.25,89.67 148.25,97.67 150.25,1.67 149.25,3.67 150.25,5.67 149.25,7.67 150.25,9.67 149.25,11.67 150.25,13.67 149.25,15.67 150.25,17.67 149.25,19.67 150.25,21.67 149.25,23.67 150.25,25.67 149.25,27.67 150.25,29.67 149.25,31.67 150.25,33.67 149.25,35.67 150.25,37.67 149.25,39.67 149.25,43.67 150.25,45.67 149.25,47.67 150.25,49.67 149.25,51.67 150.25,53.67 149.25,55.67 150.25,57.67 149.25,67.67 150.25,73.67 150.25,81.67 149.25,83.67 150.25,85.67 149.25,87.67 150.25,89.67 150.25,97.67 152.25,1.67 151.25,3.67 152.25,5.67 151.25,7.67 151.25,11.67 151.25,15.67 151.25,19.67 152.25,21.67 151.25,23.67 152.25,25.67 152.25,41.67 152.25,45.67 151.25,47.67 152.25,49.67 151.25,51.67 152.25,53.67 151.25,55.67 152.25,57.67 151.25,59.67 152.25,61.67 151.25,63.67 152.25,65.67 151.25,67.67 152.25,73.67 152.25,81.67 151.25,83.67 152.25,85.67 151.25,87.67 152.25,89.67 151.25,91.67 152.25,97.67 154.25,1.67 154.25,5.67 154.25,9.67 153.25,11.67 154.25,13.67 153.25,15.67 154.25,17.67 153.25,19.67 154.25,21.67 153.25,31.67 154.25,33.67 153.25,35.67 153.25,47.67 154.25,49.67 153.25,51.67 154.25,53.67 153.25,55.67 154.25,57.67 153.25,59.67 154.25,61.67 153.25,63.67 153.25,67.67 153.25,79.67 154.25,81.67 153.25,83.67 154.25,85.67 153.25,87.67 154.25,89.67 153.25,95.67 154.25,97.67 155.25,3.67 156.25,5.67 155.25,7.67 156.25,9.67 155.25,11.67 156.25,13.67 155.25,15.67 156.25,17.67 155.25,19.67 156.25,21.67 155.25,31.67 156.25,33.67 155.25,35.67 156.25,45.67 156.25,49.67 156.25,53.67 156.25,57.67 156.25,61.67 156.25,69.67 155.25,75.67 156.25,81.67 155.25,83.67 156.25,85.67 155.25,87.67 156.25,89.67 155.25,95.67 157.25,3.67 158.25,5.67 157.25,7.67 158.25,9.67 157.25,11.67 158.25,13.67 157.25,15.67 158.25,17.67 157.25,19.67 158.25,21.67 157.25,31.67 158.25,33.67 157.25,35.67 158.25,45.67 157.25,47.67 158.25,49.67 157.25,51.67 158.25,53.67 157.25,55.67 158.25,57.67 157.25,59.67 158.25,61.67 157.25,63.67 158.25,65.67 157.25,67.67 158.25,69.67 157.25,71.67 158.25,73.67 157.25,79.67 158.25,81.67 157.25,83.67 158.25,85.67 157.25,87.67 158.25,89.67 157.25,95.67
  pour Top: 0,0 160.02,0 160.02,100.33 0,100.33
  pour Bottom: 0,0 160.02,0 160.02,100.33 0,100.33
HP1
  Top 0.406: C4.+ R2.1 | R4.1 60.81,86.36 R2.1 | R2.1 61.11,83.52 R3.2
HP2  (via drill 0.35)
  Top 0.406: v62.23,90.17 59.84,90.17 R4.2 55.73,90.32 53.34,92.71 C5.+
  Bottom 0.406: SV2.1 64.77,82.94 64.77,87.63 v62.23,90.17
N$2
  Top 0.406: ST/MN.1 71.46,85.29 70.25,86.5 69.5,86.5 69,87 J2.TIP
N$4
  Top 0.406: J2.RING 79,88.25 78,87.25 76,87.25 74,85.25 ST/MN.2 74,81.5 73,80.5 69.85,80.5 66.04,84.31 66.04,90.17 62.23,93.98 59.84,93.98 R1.2 58.57,93.83 55.88,96.52 50.16,96.52 48.26,94.61 C5.-
NEOPIXEL
  Top 0.406: R8.2 154.94,67.31 153.67,68.58 148.37,68.58 147.32,69.63 B2.22
OPT1
  Top 0.254: S9.A2 60.05,54.32 62.23,56.5 78.35,56.5 93.26,71.41 121.88,71.41 123.52,69.76 128.11,69.76 128.14,69.72 130.43,69.72 134.62,73.91 B2.17
OPT2
  Top 0.254: S10.A2 76.75,54.32 93.43,71 121.71,71 123.39,69.32 130.6,69.32 137.16,75.88 B2.18
OPT3  (via drill 0.35)
  Top 0.254: v127,59.69 127,58.42 125.73,57.15 101.6,57.15 100.33,55.88 100.33,54.48 S19.B2 | B2.19 139.7,74.93 v127,62.23
  Bottom 0.254: v127,59.69 v127,62.23
P1A  (via drill 0.35)
  Top 0.254: v113.97,77.78 110.85,74.66 91.91,74.66 77.48,60.22 72.5,60.22 v72.5,60.48 | v38.91,17.66 38.91,17.34 39.44,16.81 39.44,11.34 37.84,9.75 19,9.75 18.5,9.25 18.5,4.75 17.75,4 16.77,4 S1.A2 | v52.34,56 52.34,54.24 39.59,41.49 v39.59,25
  Bottom 0.254: v72.5,60.48 72,60.98 71.23,60.98 70.91,60.66 55.33,60.66 52.59,57.92 52.59,56.25 v52.34,56 | v38.91,17.66 38.91,18.16 38.84,18.23 38.84,19.92 39.59,20.67 v39.59,25 | v113.97,77.78 115.42,79.23 116.48,79.23 120.44,83.19 120.44,94.09 122.66,96.31 151.34,96.31 152.4,95.25 B2.1
P1B  (via drill 0.35)
  Top 0.254: v114.92,77.8 111.38,74.25 92.08,74.25 77.65,59.82 71.76,59.82 v71.5,60.07 | S2.A2 35.6,4.1 38.25,6.75 38.25,9.41 39.84,11 39.84,17.66 39.5,18 v39.5,18.5 | v53.25,56 53.25,54.58 40.59,41.92 40.59,24.59 v40.25,24.25
  Bottom 0.254: v53.25,56 53.25,58 55.25,60 58.69,60 58.76,60.07 v71.5,60.07 | v39.5,18.5 39.5,20 40.25,20.75 v40.25,24.25 | v114.92,77.8 115.95,78.82 116.65,78.82 120.84,83.02 120.84,93.92 122.83,95.91 149.14,95.91 149.86,95.18 B2.2
P1C  (via drill 0.35)
  Top 0.254: v115.83,77.78 111.9,73.84 92.25,73.84 77.82,59.41 58.73,59.41 58.61,59.53 56.22,59.53 v54.75,58.06 | v40.25,19.5 40.25,10.83 40.83,10.25 44.75,10.25 46.75,8.25 46.75,5.5 48.25,4 49.59,4 S3.A2 | v54.25,56 54.25,55 41,41.75 v41,23.25
  Bottom 0.254: v54.75,58.06 54.75,56.5 v54.25,56 | v40.25,19.5 41,20.25 v41,23.25 | v115.83,77.78 116.47,78.42 116.83,78.42 121.25,82.84 121.25,93.75 123,95.5 147.07,95.5 147.32,95.25 B2.3
P1SL
  Top 0.254: S8.A2 33.39,55.74 45.74,55.74 47,57 78.28,57 93.09,71.81 114.16,71.81 120.83,78.48 120.83,93.05 123.11,95.33 133.6,95.33 134.62,94.31 B2.8
P1ST
  Top 0.254: S7.A2 14.84,54.84 16.14,56.15 45.57,56.15 46.83,57.41 78.11,57.41 92.92,72.22 114,72.22 120.42,78.65 120.42,93.22 122.95,95.74 134.73,95.74 137.16,93.3 B2.7
P1X  (via drill 0.35)
  Top 0.254: v116.74,77.76 112.42,73.44 92.42,73.44 77.98,59 58.56,59 58.44,59.13 56.88,59.13 56.09,58.34 56.09,58.31 v55.84,58.06 | v55.34,56 55,55.66 55,55.08 41.66,41.73 41.66,22.75 38.66,19.75 19,19.75 18.25,19 18.25,13.25 17.99,12.99 S4.A2
  Bottom 0.254: v55.84,58.06 55.34,57.56 v55.34,56 | v116.74,77.76 121.69,82.7 121.69,93.59 123.16,95.06 143.52,95.06 144.78,93.8 B2.4
P1Y  (via drill 0.35)
  Top 0.254: v117.71,77.79 112.95,73.03 92.59,73.03 78.15,58.6 58.4,58.6 58.27,58.72 57.15,58.72 56.75,58.32 v56.75,58.06 | S5.A2 33.42,12.75 34.5,12.75 35,13.25 35,18.75 35.5,19.25 39,19.25 42.06,22.31 42.06,41.56 v56.25,55.75
  Bottom 0.254: v56.75,58.06 56.75,56.25 v56.25,55.75 | v117.71,77.79 122.09,82.18 122.09,93.42 123.33,94.66 140.93,94.66 142.24,93.34 B2.5
P1Z  (via drill 0.35)
  Top 0.254: v118.62,77.78 113.47,72.63 92.75,72.63 78.19,58.06 v58,58.06 | v57.25,55.75 42.47,40.97 42.47,22.03 47.25,17.25 47.25,13.75 48.01,12.99 S6.A2
  Bottom 0.254: v58,58.06 57.81,58.06 57.25,57.5 v57.25,55.75 | v118.62,77.78 122.5,81.65 122.5,93.25 123.5,94.25 138.79,94.25 139.7,93.34 B2.6
P2A  (via drill 0.35)
  Top 0.254: v124,15 124,10 120,6 112.22,6 S11.B2 | B2.9 132.08,93.47 131.19,94.36 128.46,94.36 127.91,94.92 123.36,94.92 121.34,92.89 121.34,72.52 123.44,70.42 v127.92,70.42
  Bottom 0.254: v124,15 124.84,15.84 124.84,21.92 130.2,27.27 130.2,62.5 130,62.7 130,67.69 130,67.75 130,68.34 v127.92,70.42
P2B  (via drill 0.35)
  Top 0.254: v125.25,15 125.25,6.2 127.34,4.1 S12.B2 | B2.10 127.74,94.51 123.53,94.51 121.74,92.73 121.74,72.69 123.36,71.08 v128.55,71.08
  Bottom 0.254: v125.25,15 125.25,21.75 130.63,27.13 130.63,69 v128.55,71.08
P2C  (via drill 0.35)
  Top 0.254: v131.85,22.99 133.35,21.49 133.35,7.62 134.62,6.35 142.37,6.35 S13.B2 | B2.11 127,92.84 125.73,94.11 123.7,94.11 122.15,92.56 122.15,72.86 123.27,71.73 v129.18,71.73
  Bottom 0.254: v131.85,22.99 130.68,22.99 129.54,24.13 129.54,25.4 131.04,26.9 131.04,69.88 v129.18,71.73
P2SL  (via drill 0.35)
  Top 0.254: v139.06,56.52 141.26,54.32 S18.B2 | B2.16 132.72,76.83 v132.72,73.66
  Bottom 0.254: v139.06,56.52 133.35,56.52 132.97,56.9 132.97,67.94 133.75,68.73 133.75,70.8 133.5,71.05 133.5,72.88 v132.72,73.66
P2ST  (via drill 0.35)
  Top 0.254: S17.B2 125.73,55.12 v125.73,56.49 | v125.73,62.23 126.07,62.23 126.73,62.89 127.02,62.89 133.09,68.96 v133.09,70.52 | B2.15 129.54,74.93 130.38,74.09 v131.31,74.09
  Bottom 0.254: v125.73,56.49 v125.73,62.23 | v131.31,74.09 131.56,73.84 131.58,73.84 133.09,72.33 v133.09,70.52
P2X  (via drill 0.35)
  Top 0.254: v130.81,25.4 127,21.59 118.11,21.59 114.3,17.78 114.3,15.24 112.03,12.97 110.34,12.97 S14.B2 | B2.12 122.56,90.81 122.56,73.03 123.19,72.39 129.6,72.39 130.09,71.9 v130.09,71.83
  Bottom 0.254: v130.81,25.4 130.81,26.04 131.44,26.67 131.44,70.47 v130.09,71.83
P2Y  (via drill 0.35)
  Top 0.254: S15.B2 128.4,12.7 129.54,12.7 130.81,13.97 130.81,24.13 v132.08,25.4 | v130.54,72.66 129.91,72.66 129.54,73.03 127.64,73.03 127,73.66 125.09,73.66 124.46,74.3 B2.13
  Bottom 0.254: v132.08,25.4 131.95,25.53 131.95,70.48 131.95,70.62 131.95,71.25 v130.54,72.66
P2Z  (via drill 0.35)
  Top 0.254: v133.35,25.4 133.35,22.06 133.76,21.65 133.76,15.49 134.5,14.75 142.85,14.75 S16.B2 | v131.31,73.18 131.29,73.18 130.81,73.66 127.64,73.66 127,74.3 B2.14
  Bottom 0.254: v133.35,25.4 132.44,26.31 132.44,72.05 v131.31,73.18
SIGNAL
  Bottom 0.254: MICROPHONE.3 98.5,87.25 100.5,85.25 | B2.23 149.86,76.36 149.5,76 109.75,76 100.5,85.25 | 100.5,85.25 97.95,85.25 92.71,80.01 76.2,80.01 74,77.81 SV2.2
SW1  (via drill 0.35)
  Top 0.254: B2.20 142.24,73.66 141.38,72.8 138.84,72.8 v128.27,62.23 | v128.27,59.69 128.27,49.53 124.46,45.72 v104.14,45.72 | v99.06,45.72 96.52,43.18 69.22,43.18 68.43,42.39 R11.2 R10.1 68.43,5.23 70.19,3.46 S21.1
  Bottom 0.254: v128.27,62.23 v128.27,59.69 | v104.14,45.72 v99.06,45.72
SW1A
  Top 0.254: S20.1 71.47,16.16 70.97,16.66 R9.1 70.97,32.72 R10.2
SW2  (via drill 0.35)
  Top 0.254: v129.54,59.69 129.54,49.53 124.46,44.45 v102.87,44.45 | v99.06,44.45 95.25,40.64 R14.2 R13.1 91.44,30.63 91.44,12.76 86.64,7.96 S23.1 | v129.54,62.23 139.7,72.39 143.51,72.39 144.78,73.66 B2.21
  Bottom 0.254: v129.54,59.69 v129.54,62.23 | v99.06,44.45 v102.87,44.45
SW2A
  Top 0.254: R13.2 86.21,31.9 89.05,29.06 R12.1 88.9,26.52 88.9,21.59 87.97,20.66 S22.1
TVIN
  Top 0.813: B2.VIN 157.48,76.2 154.94,73.66 153.67,73.66 152.4,72.39 SV3.2

## Text on the board
tPlace: NEOPIXEL FEATURE DEVELOPER R2 11/4/2020 | STEREO | MONO | H M L | IF USING 3.5MM / JACK SET GAIN / TO HIGH!! | EN | DISABLE | 5VIN | JACK / ENABLE | 12/11 | 10/9/8 | 7/6 | USB | 13/14/15 | 5/4/3 | 18/17/16 | 0/1/2
tNames: 5 VIN | NP5 | NP4 | NP3 | ST | SL | ST | SL | O1 | O2 | O3 | NP6 | NP2 | NP7 | NP1 | Y | X | L | Y | X | L | SW1 | SW2 | B | A | R | B | A | R
Reference: 11-4-2020 - (R2) - R2 UPDATES: / 1. MOVED ALL CONTROLS UP ONE PIN ON TEENSY / (D0 WOULD NOT REGISTER A ON P1). / 2. REMOVED OPT4 AS IT IS NOT USED IN THE DESIGN / 3. ALL INPUT TRACES RERUN, STICHING RERUN TO MATCH NEW TRACES / 4. ADDED VIA STITCHING TO GND PLANE